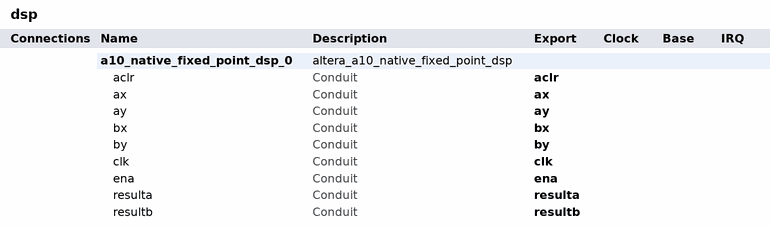
[diagram p0: system contents]
# Platform Designer (Qsys) system dsp, Arria 10 10AX115N2F45I1SG
# Parameters at their usual value, and those the tool derives, are not listed.
package require -exact qsys 20.1
create_system dsp
set_project_property DEVICE_FAMILY {Arria 10}
set_project_property DEVICE 10AX115N2F45I1SG

add_instance a10_native_fixed_point_dsp_0 altera_a10_native_fixed_point_dsp 20.1
set_instance_property a10_native_fixed_point_dsp_0 AUTO_EXPORT true
set_instance_parameter_value a10_native_fixed_point_dsp_0 accum_pipeline_clock none
set_instance_parameter_value a10_native_fixed_point_dsp_0 accumulate_clock none
set_instance_parameter_value a10_native_fixed_point_dsp_0 ax_clock none
set_instance_parameter_value a10_native_fixed_point_dsp_0 ax_width 18
set_instance_parameter_value a10_native_fixed_point_dsp_0 ay_scan_in_clock none
set_instance_parameter_value a10_native_fixed_point_dsp_0 ay_scan_in_width 18
set_instance_parameter_value a10_native_fixed_point_dsp_0 ay_use_scan_in false
set_instance_parameter_value a10_native_fixed_point_dsp_0 az_clock none
set_instance_parameter_value a10_native_fixed_point_dsp_0 az_width 0
set_instance_parameter_value a10_native_fixed_point_dsp_0 bx_clock none
set_instance_parameter_value a10_native_fixed_point_dsp_0 bx_width 18
set_instance_parameter_value a10_native_fixed_point_dsp_0 by_clock none
set_instance_parameter_value a10_native_fixed_point_dsp_0 by_use_scan_in false
set_instance_parameter_value a10_native_fixed_point_dsp_0 by_width 18
set_instance_parameter_value a10_native_fixed_point_dsp_0 bz_clock none
set_instance_parameter_value a10_native_fixed_point_dsp_0 bz_width 0
set_instance_parameter_value a10_native_fixed_point_dsp_0 coef_a_0 0
set_instance_parameter_value a10_native_fixed_point_dsp_0 coef_a_1 0
set_instance_parameter_value a10_native_fixed_point_dsp_0 coef_a_2 0
set_instance_parameter_value a10_native_fixed_point_dsp_0 coef_a_3 0
set_instance_parameter_value a10_native_fixed_point_dsp_0 coef_a_4 0
set_instance_parameter_value a10_native_fixed_point_dsp_0 coef_a_5 0
set_instance_parameter_value a10_native_fixed_point_dsp_0 coef_a_6 0
set_instance_parameter_value a10_native_fixed_point_dsp_0 coef_a_7 0
set_instance_parameter_value a10_native_fixed_point_dsp_0 coef_b_0 0
set_instance_parameter_value a10_native_fixed_point_dsp_0 coef_b_1 0
set_instance_parameter_value a10_native_fixed_point_dsp_0 coef_b_2 0
set_instance_parameter_value a10_native_fixed_point_dsp_0 coef_b_3 0
set_instance_parameter_value a10_native_fixed_point_dsp_0 coef_b_4 0
set_instance_parameter_value a10_native_fixed_point_dsp_0 coef_b_5 0
set_instance_parameter_value a10_native_fixed_point_dsp_0 coef_b_6 0
set_instance_parameter_value a10_native_fixed_point_dsp_0 coef_b_7 0
set_instance_parameter_value a10_native_fixed_point_dsp_0 coef_sel_a_clock none
set_instance_parameter_value a10_native_fixed_point_dsp_0 coef_sel_b_clock none
set_instance_parameter_value a10_native_fixed_point_dsp_0 delay_scan_out_ay false
set_instance_parameter_value a10_native_fixed_point_dsp_0 delay_scan_out_by false
set_instance_parameter_value a10_native_fixed_point_dsp_0 enable_accumulate false
set_instance_parameter_value a10_native_fixed_point_dsp_0 enable_double_accum false
set_instance_parameter_value a10_native_fixed_point_dsp_0 enable_loadconst false
set_instance_parameter_value a10_native_fixed_point_dsp_0 enable_negate false
set_instance_parameter_value a10_native_fixed_point_dsp_0 enable_sub false
set_instance_parameter_value a10_native_fixed_point_dsp_0 gui_chainout_enable false
set_instance_parameter_value a10_native_fixed_point_dsp_0 gui_scanout_enable false
set_instance_parameter_value a10_native_fixed_point_dsp_0 input_pipeline_clock 0
set_instance_parameter_value a10_native_fixed_point_dsp_0 load_const_clock none
set_instance_parameter_value a10_native_fixed_point_dsp_0 load_const_pipeline_clock none
set_instance_parameter_value a10_native_fixed_point_dsp_0 load_const_value 0
set_instance_parameter_value a10_native_fixed_point_dsp_0 mode_sub_location 0
set_instance_parameter_value a10_native_fixed_point_dsp_0 negate_clock none
set_instance_parameter_value a10_native_fixed_point_dsp_0 negate_pipeline_clock none
set_instance_parameter_value a10_native_fixed_point_dsp_0 operand_source_max input
set_instance_parameter_value a10_native_fixed_point_dsp_0 operand_source_may input
set_instance_parameter_value a10_native_fixed_point_dsp_0 operand_source_mbx input
set_instance_parameter_value a10_native_fixed_point_dsp_0 operand_source_mby input
set_instance_parameter_value a10_native_fixed_point_dsp_0 operation_mode m18x18_full
set_instance_parameter_value a10_native_fixed_point_dsp_0 output_clock 0
set_instance_parameter_value a10_native_fixed_point_dsp_0 preadder_subtract_a false
set_instance_parameter_value a10_native_fixed_point_dsp_0 preadder_subtract_b false
set_instance_parameter_value a10_native_fixed_point_dsp_0 result_a_width 37
set_instance_parameter_value a10_native_fixed_point_dsp_0 result_b_width 37
set_instance_parameter_value a10_native_fixed_point_dsp_0 scan_out_width 18
set_instance_parameter_value a10_native_fixed_point_dsp_0 signed_max false
set_instance_parameter_value a10_native_fixed_point_dsp_0 signed_may true
set_instance_parameter_value a10_native_fixed_point_dsp_0 signed_mbx false
set_instance_parameter_value a10_native_fixed_point_dsp_0 signed_mby true
set_instance_parameter_value a10_native_fixed_point_dsp_0 sub_clock none
set_instance_parameter_value a10_native_fixed_point_dsp_0 sub_pipeline_clock none
set_instance_parameter_value a10_native_fixed_point_dsp_0 use_chainadder false

# exported interfaces
add_interface aclr conduit end
set_interface_property aclr EXPORT_OF a10_native_fixed_point_dsp_0.aclr
add_interface ax conduit end
set_interface_property ax EXPORT_OF a10_native_fixed_point_dsp_0.ax
add_interface ay conduit end
set_interface_property ay EXPORT_OF a10_native_fixed_point_dsp_0.ay
add_interface bx conduit end
set_interface_property bx EXPORT_OF a10_native_fixed_point_dsp_0.bx
add_interface by conduit end
set_interface_property by EXPORT_OF a10_native_fixed_point_dsp_0.by
add_interface clk conduit end
set_interface_property clk EXPORT_OF a10_native_fixed_point_dsp_0.clk
add_interface ena conduit end
set_interface_property ena EXPORT_OF a10_native_fixed_point_dsp_0.ena
add_interface resulta conduit end
set_interface_property resulta EXPORT_OF a10_native_fixed_point_dsp_0.resulta
add_interface resultb conduit end
set_interface_property resultb EXPORT_OF a10_native_fixed_point_dsp_0.resultb

set_interconnect_requirement {$system} qsys_mm.clockCrossingAdapter HANDSHAKE
set_interconnect_requirement {$system} qsys_mm.enableEccProtection FALSE
set_interconnect_requirement {$system} qsys_mm.insertDefaultSlave FALSE
set_interconnect_requirement {$system} qsys_mm.maxAdditionalLatency 1

save_system dsp.qsys
